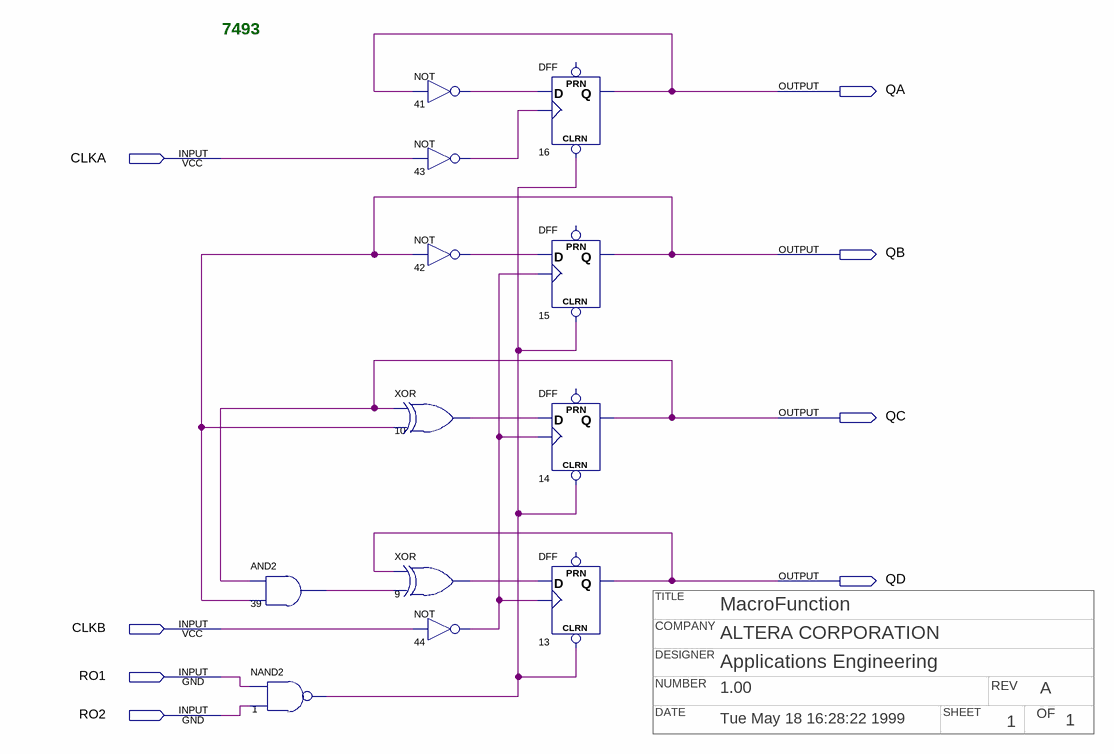
[diagram p0: schematic sheet]
// Quartus schematic 7493.bdf as structural Verilog: 12 symbols, 8 pins
// Title block: TITLE: MacroFunction; COMPANY: ALTERA CORPORATION; DESIGNER: Applications Engineering; NUMBER: 1.00; REV: A; DATE: Tue May 18 16:28:22 1999; SHEET: 1; OF: 1
module \7493  (
  input  CLKA,
  input  CLKB,
  input  RO1,
  input  RO2,
  output QA,
  output QB,
  output QC,
  output QD
);

  wire n1_out, n9_out, n10_out, n39_out, n41_out, n42_out, n43_out, n44_out;

  and u_39 (n39_out, QC, QB);
  nand u_1 (n1_out, RO1, RO2);
  not u_41 (n41_out, QA);
  not u_43 (n43_out, CLKA);
  not u_42 (n42_out, QB);
  xor u_10 (n10_out, QC, QB);
  xor u_9 (n9_out, QD, n39_out);
  not u_44 (n44_out, CLKB);
  DFF u_16 (.CLRN(n1_out), .CLK(n43_out), .D(n41_out), .Q(QA));  // open: PRN
  DFF u_15 (.CLRN(n1_out), .CLK(n44_out), .D(n42_out), .Q(QB));  // open: PRN
  DFF u_14 (.CLRN(n1_out), .CLK(n44_out), .D(n10_out), .Q(QC));  // open: PRN
  DFF u_13 (.CLRN(n1_out), .CLK(n44_out), .D(n9_out), .Q(QD));  // open: PRN

  // Notes on the sheet:
  //   7493
endmodule
